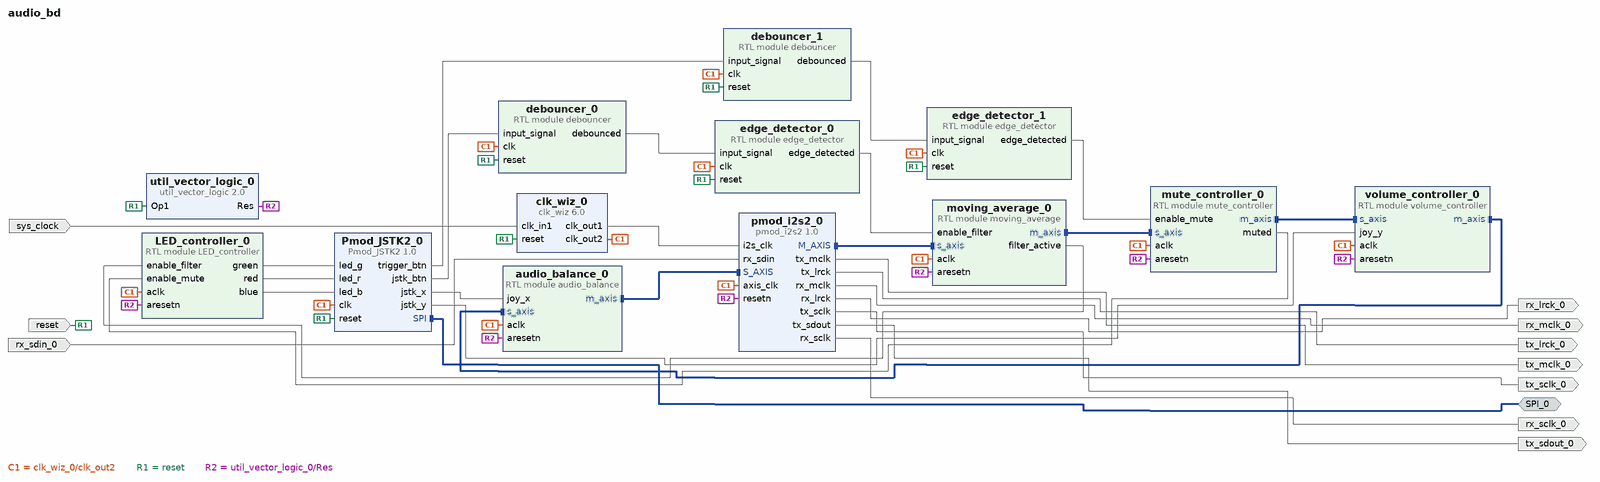
[diagram p0: block diagram of the top level]
# Vivado block design audio_bd, xc7a35tcpg236-1, Vivado 2020.2
create_bd_design audio_bd

create_bd_intf_port -mode Master -vlnv xilinx.com:interface:spi_rtl:1.0 SPI_0
create_bd_port -dir I -type clk sys_clock
set_property -dict {CONFIG.FREQ_HZ 100000000 CONFIG.PHASE 0.000} [get_bd_ports sys_clock]
create_bd_port -dir I -type rst reset
set_property -dict {CONFIG.POLARITY ACTIVE_HIGH} [get_bd_ports reset]
create_bd_port -dir I rx_sdin_0
create_bd_port -dir O tx_mclk_0
create_bd_port -dir O tx_lrck_0
create_bd_port -dir O tx_sclk_0
create_bd_port -dir O tx_sdout_0
create_bd_port -dir O rx_mclk_0
create_bd_port -dir O rx_lrck_0
create_bd_port -dir O rx_sclk_0

create_bd_cell -type ip -vlnv TimeEngineers:ip:pmod_i2s2:1.0 pmod_i2s2_0
create_bd_cell -type ip -vlnv xilinx.com:ip:clk_wiz:6.0 clk_wiz_0
set_property -dict [list \
  CONFIG.CLKOUT1_JITTER 178.913 \
  CONFIG.CLKOUT1_PHASE_ERROR 98.575 \
  CONFIG.CLKOUT1_REQUESTED_OUT_FREQ 22.591 \
  CONFIG.CLKOUT2_JITTER 130.958 \
  CONFIG.CLKOUT2_PHASE_ERROR 98.575 \
  CONFIG.CLKOUT2_USED true \
  CONFIG.CLK_IN1_BOARD_INTERFACE sys_clock \
  CONFIG.MMCM_CLKFBOUT_MULT_F 10.000 \
  CONFIG.MMCM_CLKOUT0_DIVIDE_F 44.250 \
  CONFIG.MMCM_CLKOUT1_DIVIDE 10 \
  CONFIG.MMCM_DIVCLK_DIVIDE 1 \
  CONFIG.NUM_OUT_CLKS 2 \
  CONFIG.RESET_BOARD_INTERFACE reset \
  CONFIG.USE_BOARD_FLOW true \
] [get_bd_cells clk_wiz_0]
create_bd_cell -type ip -vlnv xilinx.com:ip:util_vector_logic:2.0 util_vector_logic_0
set_property -dict {CONFIG.C_OPERATION not CONFIG.C_SIZE 1} [get_bd_cells util_vector_logic_0]
create_bd_cell -type ip -vlnv TimeEngineers:ip:Pmod_JSTK2:1.0 Pmod_JSTK2_0
create_bd_cell -type module -reference moving_average moving_average_0
create_bd_cell -type module -reference debouncer debouncer_0
create_bd_cell -type module -reference debouncer debouncer_1
create_bd_cell -type module -reference edge_detector edge_detector_0
create_bd_cell -type module -reference edge_detector edge_detector_1
create_bd_cell -type module -reference mute_controller mute_controller_0
create_bd_cell -type module -reference LED_controller LED_controller_0
create_bd_cell -type module -reference volume_controller volume_controller_0
create_bd_cell -type module -reference audio_balance audio_balance_0

# ---- connections ----

connect_bd_intf_net [get_bd_intf_ports SPI_0] [get_bd_intf_pins Pmod_JSTK2_0/SPI]
connect_bd_intf_net [get_bd_intf_pins pmod_i2s2_0/M_AXIS] [get_bd_intf_pins moving_average_0/s_axis]
connect_bd_intf_net [get_bd_intf_pins mute_controller_0/m_axis] [get_bd_intf_pins volume_controller_0/s_axis]
connect_bd_intf_net [get_bd_intf_pins moving_average_0/m_axis] [get_bd_intf_pins mute_controller_0/s_axis]
connect_bd_intf_net [get_bd_intf_pins volume_controller_0/m_axis] [get_bd_intf_pins audio_balance_0/s_axis]
connect_bd_intf_net [get_bd_intf_pins audio_balance_0/m_axis] [get_bd_intf_pins pmod_i2s2_0/S_AXIS]
connect_bd_net [get_bd_ports sys_clock] [get_bd_pins clk_wiz_0/clk_in1]
connect_bd_net [get_bd_pins clk_wiz_0/clk_out1] [get_bd_pins pmod_i2s2_0/i2s_clk]
connect_bd_net [get_bd_pins clk_wiz_0/clk_out2] \
  [get_bd_pins pmod_i2s2_0/axis_clk] [get_bd_pins Pmod_JSTK2_0/clk] [get_bd_pins moving_average_0/aclk] \
  [get_bd_pins debouncer_0/clk] [get_bd_pins debouncer_1/clk] [get_bd_pins edge_detector_0/clk] \
  [get_bd_pins edge_detector_1/clk] [get_bd_pins mute_controller_0/aclk] [get_bd_pins LED_controller_0/aclk] \
  [get_bd_pins volume_controller_0/aclk] [get_bd_pins audio_balance_0/aclk]
connect_bd_net [get_bd_ports reset] \
  [get_bd_pins clk_wiz_0/reset] [get_bd_pins util_vector_logic_0/Op1] [get_bd_pins Pmod_JSTK2_0/reset] \
  [get_bd_pins debouncer_1/reset] [get_bd_pins debouncer_0/reset] [get_bd_pins edge_detector_0/reset] \
  [get_bd_pins edge_detector_1/reset]
connect_bd_net [get_bd_pins util_vector_logic_0/Res] \
  [get_bd_pins pmod_i2s2_0/resetn] [get_bd_pins moving_average_0/aresetn] [get_bd_pins mute_controller_0/aresetn] \
  [get_bd_pins LED_controller_0/aresetn] [get_bd_pins volume_controller_0/aresetn] [get_bd_pins audio_balance_0/aresetn]
connect_bd_net -net rx_sdin_0_1 [get_bd_ports rx_sdin_0] [get_bd_pins pmod_i2s2_0/rx_sdin]
connect_bd_net [get_bd_pins pmod_i2s2_0/tx_mclk] [get_bd_ports tx_mclk_0]
connect_bd_net [get_bd_pins pmod_i2s2_0/tx_lrck] [get_bd_ports tx_lrck_0]
connect_bd_net [get_bd_pins pmod_i2s2_0/tx_sclk] [get_bd_ports tx_sclk_0]
connect_bd_net [get_bd_pins pmod_i2s2_0/tx_sdout] [get_bd_ports tx_sdout_0]
connect_bd_net [get_bd_pins pmod_i2s2_0/rx_mclk] [get_bd_ports rx_mclk_0]
connect_bd_net [get_bd_pins pmod_i2s2_0/rx_lrck] [get_bd_ports rx_lrck_0]
connect_bd_net [get_bd_pins pmod_i2s2_0/rx_sclk] [get_bd_ports rx_sclk_0]
connect_bd_net [get_bd_pins LED_controller_0/green] [get_bd_pins Pmod_JSTK2_0/led_g]
connect_bd_net [get_bd_pins LED_controller_0/red] [get_bd_pins Pmod_JSTK2_0/led_r]
connect_bd_net [get_bd_pins LED_controller_0/blue] [get_bd_pins Pmod_JSTK2_0/led_b]
connect_bd_net [get_bd_pins edge_detector_0/edge_detected] [get_bd_pins moving_average_0/enable_filter]
connect_bd_net [get_bd_pins moving_average_0/filter_active] [get_bd_pins LED_controller_0/enable_filter]
connect_bd_net [get_bd_pins Pmod_JSTK2_0/trigger_btn] [get_bd_pins debouncer_1/input_signal]
connect_bd_net [get_bd_pins debouncer_1/debounced] [get_bd_pins edge_detector_1/input_signal]
connect_bd_net [get_bd_pins Pmod_JSTK2_0/jstk_btn] [get_bd_pins debouncer_0/input_signal]
connect_bd_net [get_bd_pins debouncer_0/debounced] [get_bd_pins edge_detector_0/input_signal]
connect_bd_net [get_bd_pins mute_controller_0/muted] [get_bd_pins LED_controller_0/enable_mute]
connect_bd_net [get_bd_pins edge_detector_1/edge_detected] [get_bd_pins mute_controller_0/enable_mute]
connect_bd_net [get_bd_pins Pmod_JSTK2_0/jstk_y] [get_bd_pins volume_controller_0/joy_y]
connect_bd_net [get_bd_pins Pmod_JSTK2_0/jstk_x] [get_bd_pins audio_balance_0/joy_x]

validate_bd_design
save_bd_design
